# EAGLE schematic thopi_0_1 (EAGLE 9.3.2)
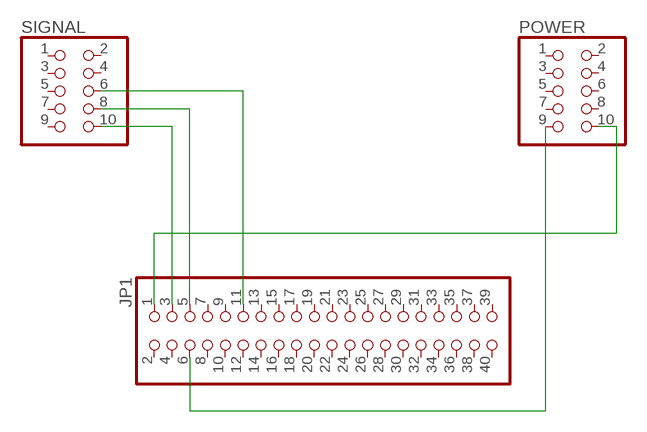
[diagram p0: schematic, sheet 1]

## Parts
JP1  PINHD-2X20  [2X20]
POWER  PINHD-2X5  [2X05]
SIGNAL  PINHD-2X5  [2X05]

## Nets
N$1: JP1.1 POWER.10
N$2: JP1.3 SIGNAL.10
N$3: JP1.5 SIGNAL.8
N$4: JP1.11 SIGNAL.6
N$5: JP1.6 POWER.9
Unconnected: JP1.2 JP1.4 JP1.7 JP1.8 JP1.9 JP1.10 JP1.12 JP1.13 JP1.14 JP1.15 JP1.16 JP1.17 JP1.18 JP1.19 JP1.20 JP1.21 JP1.22 JP1.23 JP1.24 JP1.25 JP1.26 JP1.27 JP1.28 JP1.29 JP1.30 JP1.31 JP1.32 JP1.33 JP1.34 JP1.35 JP1.36 JP1.37 JP1.38 JP1.39 JP1.40 POWER.1 POWER.2 POWER.3 POWER.4 POWER.5 POWER.6 POWER.7 POWER.8 SIGNAL.1 SIGNAL.2 SIGNAL.3 SIGNAL.4 SIGNAL.5 SIGNAL.7 SIGNAL.9

## Library data of the parts
JP1 = pinhead:PINHD-2X20: PIN HEADER
POWER SIGNAL = pinhead:PINHD-2X5: PIN HEADER